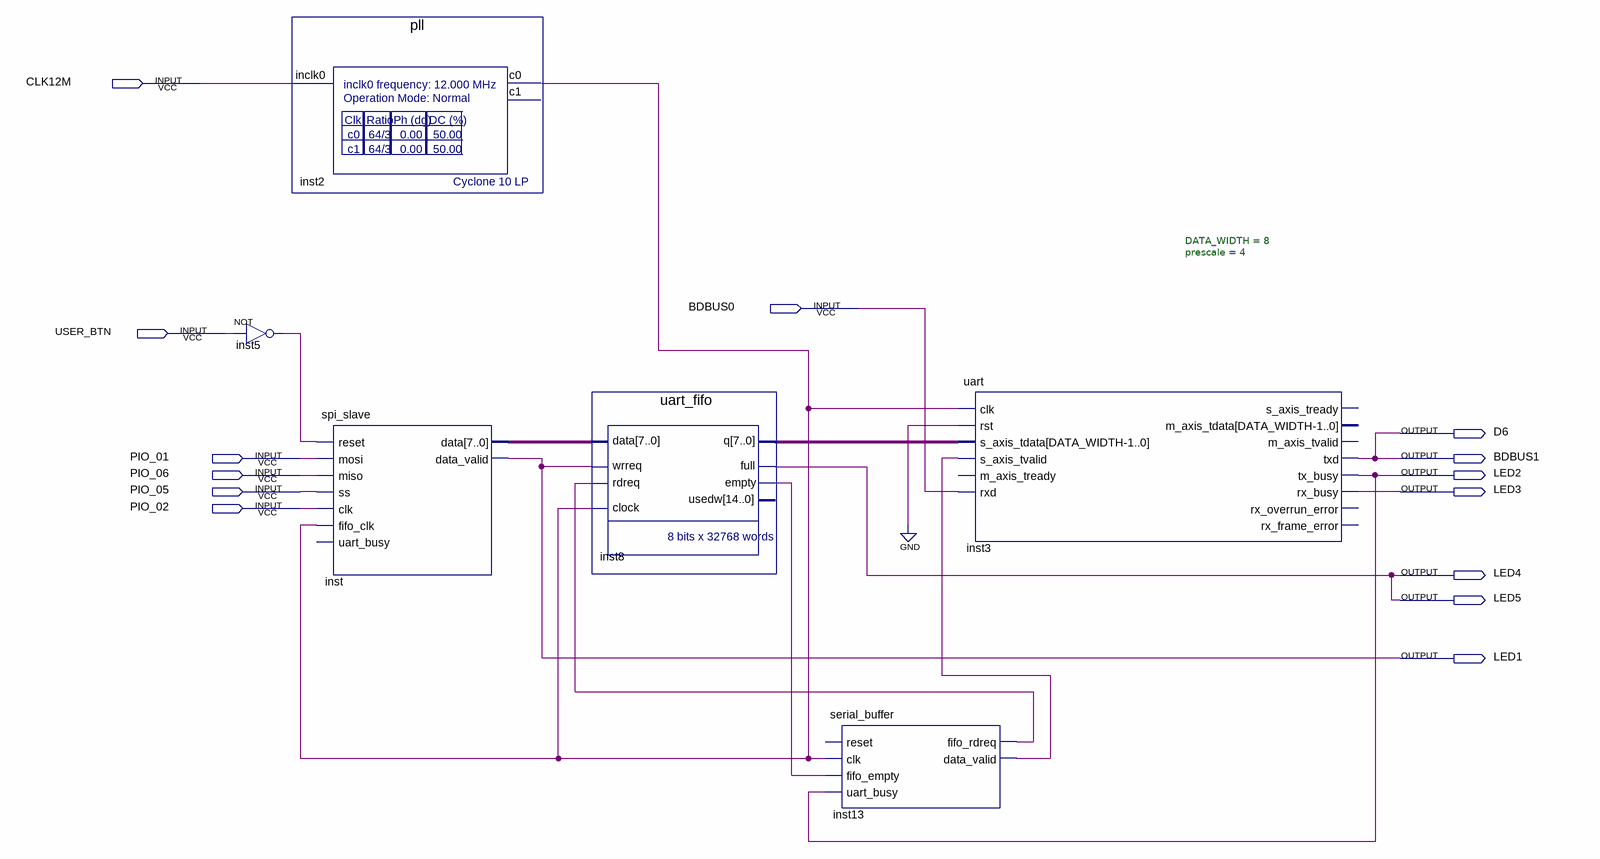
[diagram p0: schematic sheet]
// Quartus schematic SPIlog.bdf as structural Verilog: 6 symbols, 14 pins
module SPIlog (
  input  CLK12M,
  input  BDBUS0,
  input  USER_BTN,
  input  PIO_01,
  input  PIO_06,
  input  PIO_05,
  input  PIO_02,
  output D6,
  output BDBUS1,
  output LED2,
  output LED3,
  output LED4,
  output LED5,
  output LED1
);

  wire inst2_c0, inst5_out, inst8_empty, inst13_data_valid, inst13_fifo_rdreq;
  wire [7:0] inst8_q, inst_data;

  pll inst2 (.inclk0(CLK12M), .c0(inst2_c0));  // open: c1
  not inst5 (inst5_out, USER_BTN);
  spi_slave inst (
    .reset(inst5_out), .mosi(PIO_01), .miso(PIO_06), .ss(PIO_05), .clk(PIO_02), .fifo_clk(inst2_c0),
    .data(inst_data), .data_valid(LED1));  // open: uart_busy
  uart_fifo inst8 (
    .data(inst_data), .wrreq(LED1), .rdreq(inst13_fifo_rdreq), .clock(inst2_c0), .q(inst8_q), .full(LED4),
    .empty(inst8_empty));  // open: usedw
  serial_buffer inst13 (
    .clk(inst2_c0), .fifo_empty(inst8_empty), .uart_busy(LED2), .fifo_rdreq(inst13_fifo_rdreq),
    .data_valid(inst13_data_valid));  // open: reset
  uart #(.DATA_WIDTH(8), .prescale(4)) inst3 (
    .clk(inst2_c0), .rst(1'b0), .s_axis_tdata(inst8_q), .s_axis_tvalid(inst13_data_valid), .rxd(BDBUS0),
    .txd(BDBUS1), .tx_busy(LED2), .rx_busy(LED3));  // open: m_axis_tready, s_axis_tready, m_axis_tdata, m_axis_tvalid, rx_overrun_error, rx_frame_error

  assign D6 = BDBUS1;
  assign LED5 = LED4;
endmodule
